# EAGLE design Final Board Miniaturized (EAGLE 7.2.0)
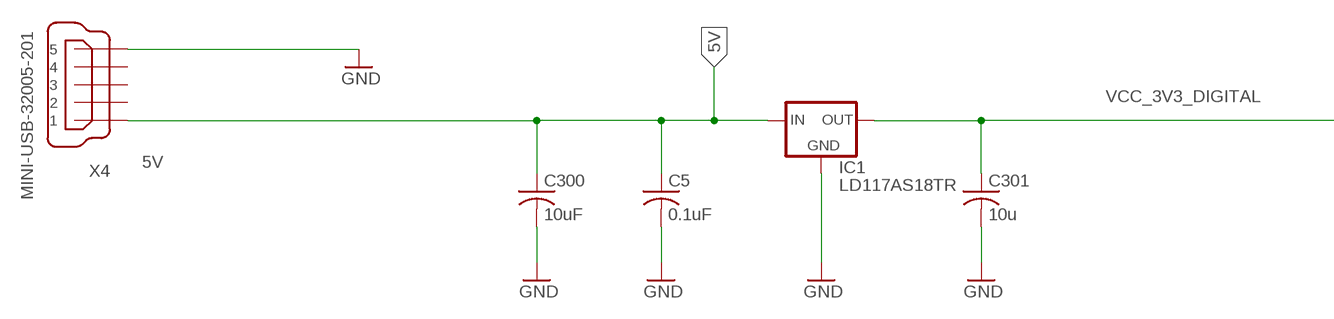
[diagram p0: schematic, sheet 1, part 1 of 2]
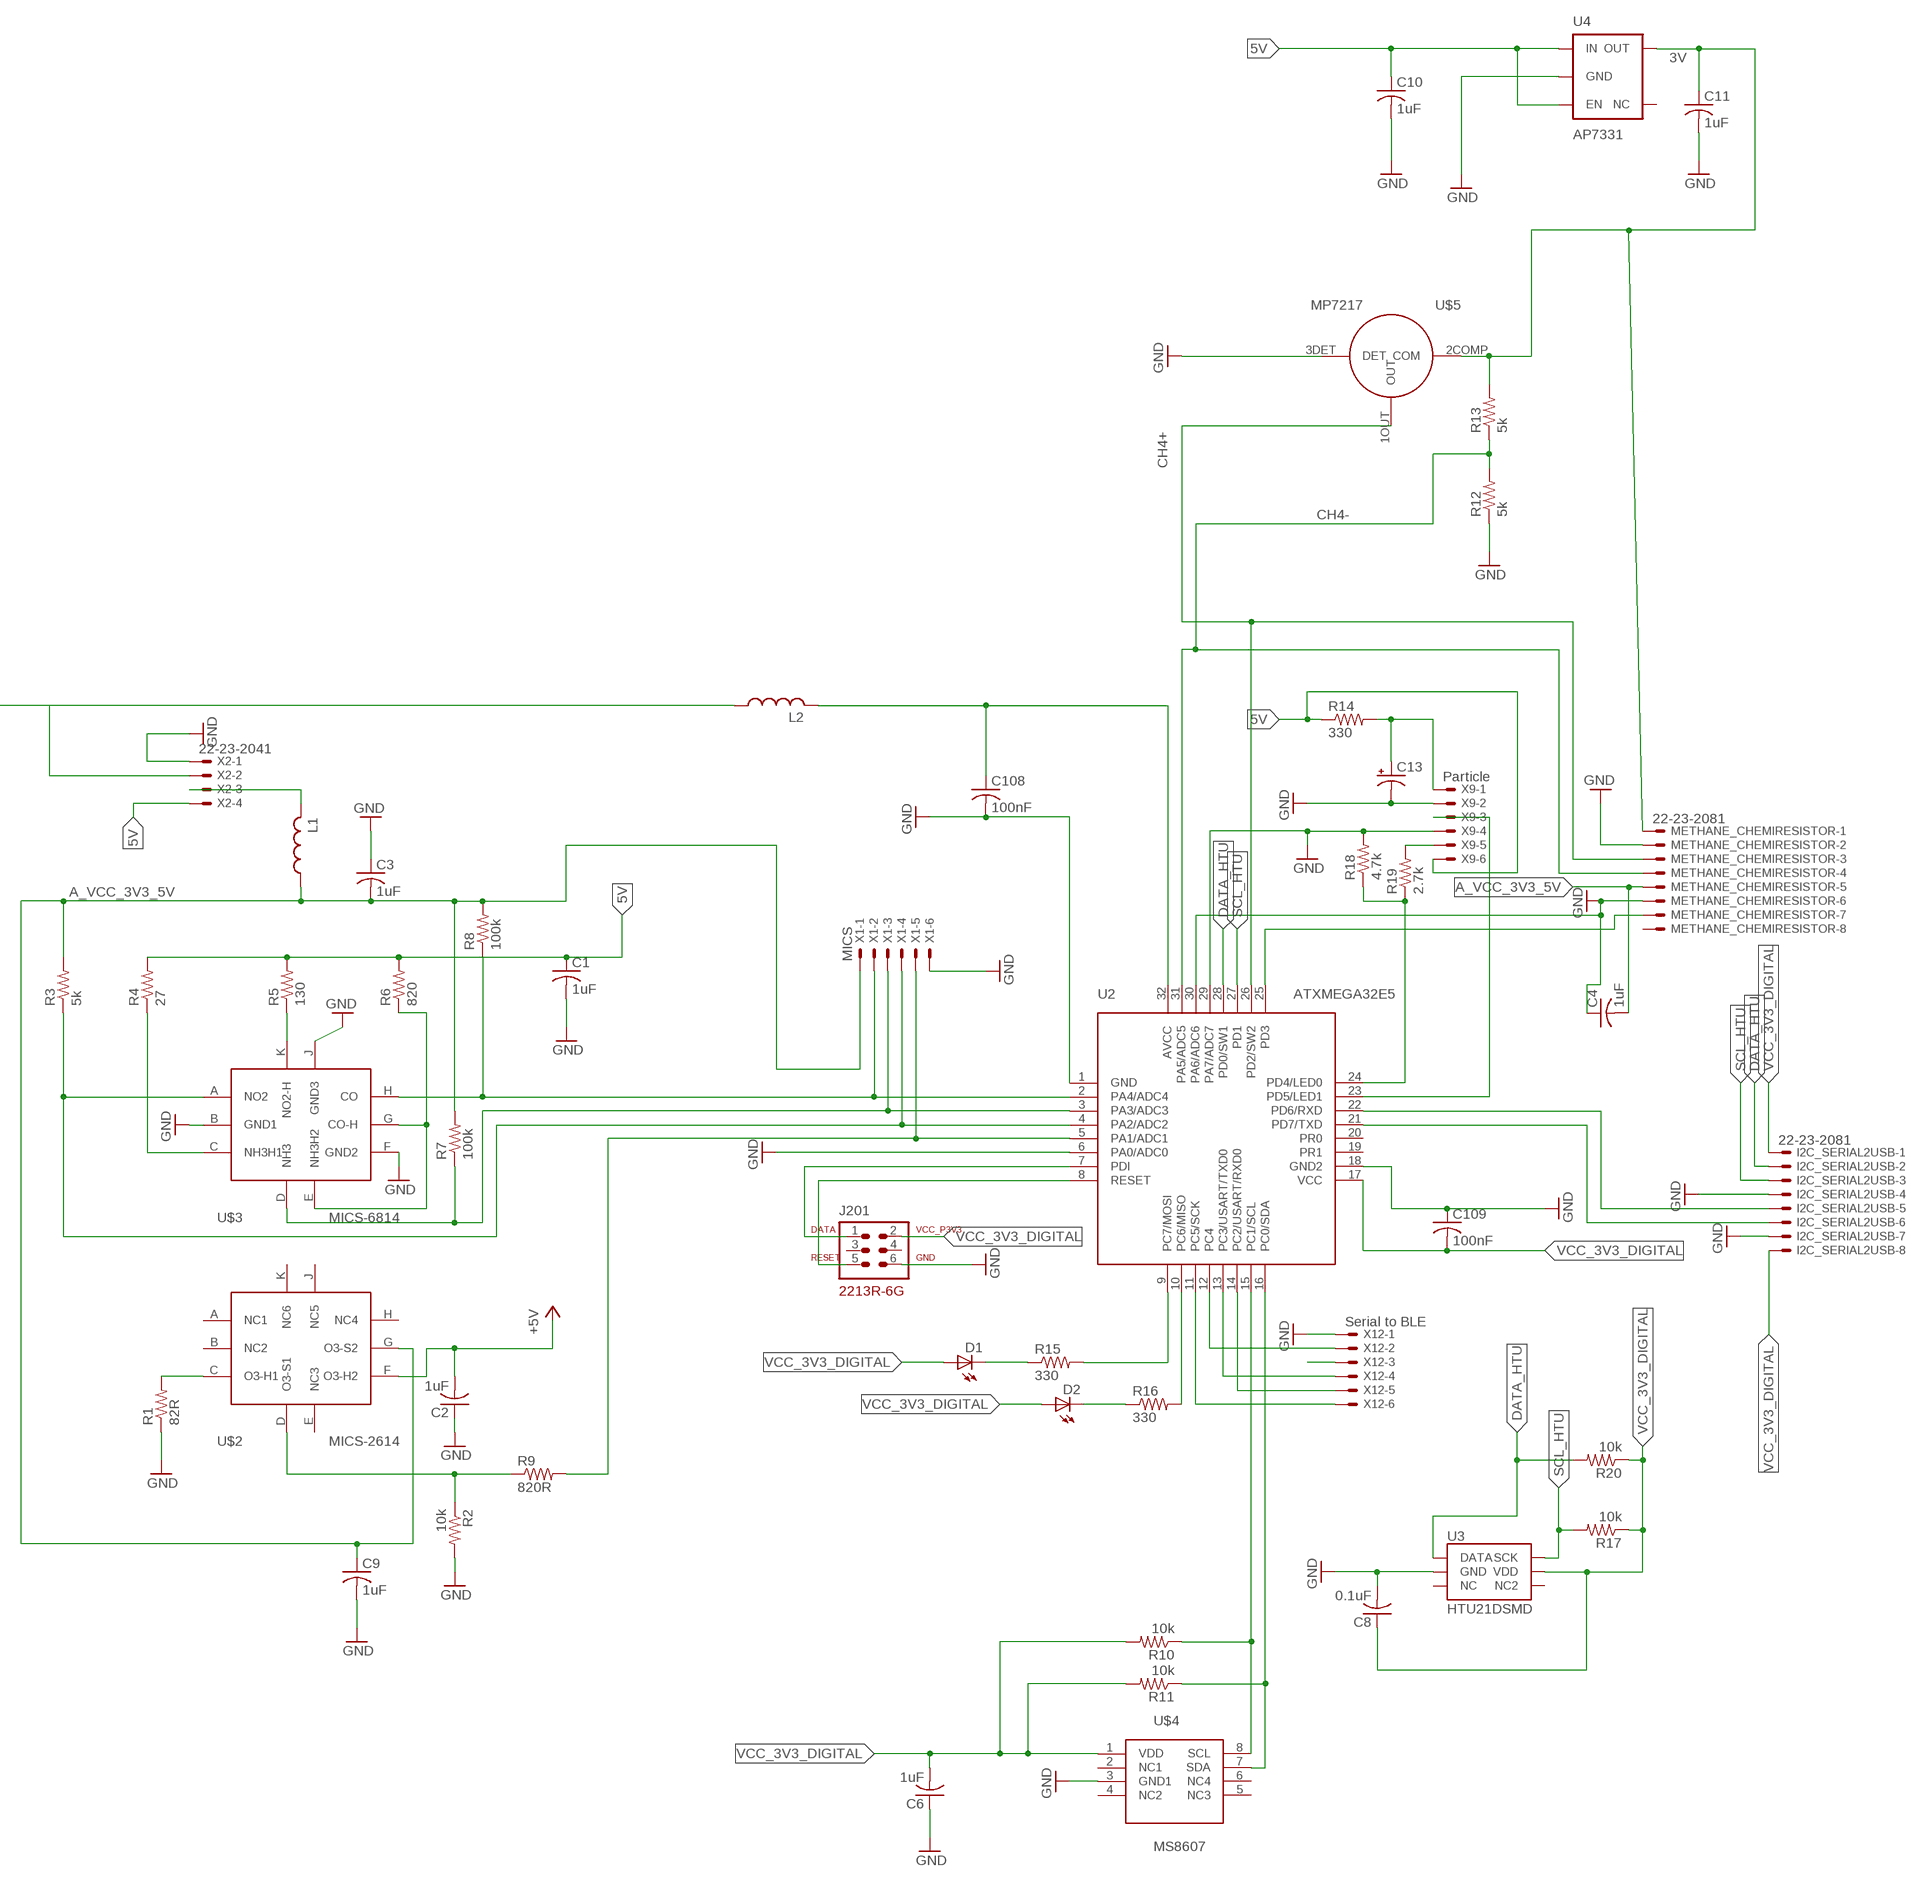
[diagram p1: schematic, sheet 1, part 2 of 2]

## Parts
C1  1uF  C-USC0805  [C0805]
C2  1uF  C-USC0805  [C0805]
C3  1uF  C-USC0805  [C0805]
C4  1uF  C-USC0805  [C0805]
C5  0.1uF  C-USC0603  [C0603]
C6  1uF  C-USC0805  [C0805]
C8  0.1uF  C-USC0805  [C0805]
C9  1uF  C-USC0805  [C0805]
C10  1uF  C-USC0805  [C0805]
C11  1uF  C-USC0805  [C0805]
C13  CPOL-USD  [PANASONIC_D]
C108  100nF  C-USC0402  [C0402]
C109  100nF  C-USC0402  [C0402]
C300  10uF  C-USC1206  [C1206]
C301  10u  C-USC1206  [C1206]
D1  LEDSML0805  [SML0805]
D2  LEDSML0805  [SML0805]
I2C_SERIAL2USB  22-23-2081  [22-23-2081]
IC1  LD117AS18TR  [SOT223]
J201  PDI  AVR-ISP-6  [AVR-ISP-6]
L1  0603INDUCTOR  [R0603]
L2  0603INDUCTOR  [R0603]
METHANE_CHEMIRESISTOR  22-23-2081  [22-23-2081]
R1  82R  R-US_R0805  [R0805]
R2  10k  R-US_R0805  [R0805]
R3  5k  R-US_R0805  [R0805]
R4  27  R-US_R0805  [R0805]
R5  130  R-US_R0805  [R0805]
R6  820  R-US_R0805  [R0805]
R7  100k  R-US_R0805  [R0805]
R8  100k  R-US_R0805  [R0805]
R9  820R  R-US_R0805  [R0805]
R10  10k  R-US_R0805  [R0805]
R11  10k  R-US_R0805  [R0805]
R12  5k  R-US_R0805  [R0805]
R13  5k  R-US_R0805  [R0805]
R14  330  R-US_R0402  [R0402]
R15  330  R-US_R0402  [R0402]
R16  330  R-US_R0402  [R0402]
R17  10k  R-US_R0805  [R0805]
R18  4.7k  R-US_R0402  [R0402]
R19  2.7k  R-US_R0402  [R0402]
R20  10k  R-US_R0805  [R0805]
U2  ATMEGA328P_TQFP  ATXMEGA32E5  [ATXMEGA32E5]
U3  HTU21DSMD  [HTU21D]
U4  AP2202-ADJ  AP7331  [AP7331]
U$2  MICS-2614-SMD8  [MICS-2614-SMD8]
U$3  MICS-6814-SMD8  [MICS-6814-SMD8]
U$4  PTH  [PTHSENSOR]
U$5  MP-7217  [MP-7217]
X1  MICS  22-23-2061  [22-23-2061]
X2  22-23-2041  [22-23-2041]
X4  MINI-USB-32005-201  [32005-201]
X9  Particle  22-23-2061  [22-23-2061]
X12  Serial to BLE  22-23-2061  [22-23-2061]

## Nets
3V: C11.1 METHANE_CHEMIRESISTOR.1 R13.2 U4.5(OUT) U$5.2COMP(COM)
5V: C1.1 C2.2 C5.1 C10.1 C300.1 IC1.3(IN) R4.2 R5.2 R6.2 R14.1 U4.1(IN) U4.3(EN) U$2.F(O3-H2) X2.4 X4.1 X9.6 ; supply symbol labelled +5V
A_VCC_3V3_5V: C3.2 C4.2 C9.1 L1.1 METHANE_CHEMIRESISTOR.5 R3.2 R7.2 R8.2 U$2.G(O3-S2) X1.1
ADC: R9.2 U2.5(PA1/ADC1) X1.5
AVCC_MC: C108.1 L2.2 U2.32(AVCC)
CH4+: METHANE_CHEMIRESISTOR.3 U2.26(PD2/SW2) U$5.1OUT(OUT)
CH4-: METHANE_CHEMIRESISTOR.4 R12.2 R13.1 U2.31(PA5/ADC5)
DATA_HTU: I2C_SERIAL2USB.2 R20.2 U2.28(PD0/SW1) U3.DATA
GND: C1.2 C2.1 C3.1 C4.1 C5.2 C6.1 C8.2 C9.2 C10.2 C11.2 C13.- C108.2 C109.1 C300.2 C301.2 I2C_SERIAL2USB.4 I2C_SERIAL2USB.7 IC1.1(GND) J201.6(GND) METHANE_CHEMIRESISTOR.2 METHANE_CHEMIRESISTOR.6 R1.1 R2.2 R12.1 R18.2 U2.1(GND) U2.6(PA0/ADC0) U2.18(GND2) U2.29(PA7/ADC7) U2.30(PA6/ADC6) U3.GND U4.2(GND) U$3.B(GND1) U$3.F(GND2) U$3.J(GND3) U$4.3(GND1) U$5.3DET(DET) X1.6 X2.1 X4.5 X9.2 X9.4 X12.1
IC1: R3.1 U2.4(PA2/ADC2) U$3.A(NO2) X1.4
N$1: R1.2 U$2.C(O3-H1)
N$2: J201.1(DATA) U2.7(PDI)
N$3: J201.5(RESET) U2.8(RESET)
N$4: R16.2 U2.10(PC6/MISO)
N$5: METHANE_CHEMIRESISTOR.7 U2.25(PD3)
N$6: I2C_SERIAL2USB.5 U2.22(PD6/RXD)
N$7: R7.1 U2.3(PA3/ADC3) U$3.D(NH3) X1.3
N$8: R6.1 U$3.E(NH3H2) U$3.G(CO-H)
N$9: R5.1 U$3.K(NO2-H)
N$10: R4.1 U$3.C(NH3H1)
N$12: R8.1 U2.2(PA4/ADC4) U$3.H(CO) X1.2
N$14: R10.1 U2.15(PC1/SCL) U$4.8(SCL)
N$15: R18.1 R19.1 U2.24(PD4/LED0)
N$16: U2.23(PD5/LED1) X9.3
N$17: R11.1 U2.16(PC0/SDA) U$4.7(SDA)
N$18: R19.2 X9.5
N$19: U2.13(PC3/USART/TXD0) X12.4
N$20: U2.14(PC2/USART/RXD0) X12.5
N$21: R2.1 R9.1 U$2.D(O3-S1)
N$22: C13.+ R14.2 X9.1
N$23: L1.2 X2.3
N$24: I2C_SERIAL2USB.6 U2.21(PD7/TXD)
N$26: D1.C R15.1
N$27: U2.12(PC4) X12.2
N$28: D2.C R16.1
N$29: R15.2 U2.9(PC7/MOSI)
N$31: U2.11(PC5/SCK) X12.6
N$32: X12.3
SCL_HTU: I2C_SERIAL2USB.3 R17.2 U2.27(PD1) U3.SCK
VCC_3V3_DIGITAL: C6.2 C8.1 C109.2 C301.1 D1.A D2.A I2C_SERIAL2USB.1 I2C_SERIAL2USB.8 IC1.2(OUT) J201.2(VCC_P3V3) L2.1 R10.2 R11.2 R17.1 R20.1 U2.17(VCC) U3.VDD U$4.1(VDD) X2.2
Unconnected: J201.3(NC1) J201.4(NC2) METHANE_CHEMIRESISTOR.8 U2.19(PR1) U2.20(PR0) U3.NC@6(NC2) U4.4(NC) U$2.A(NC1) U$2.B(NC2) U$2.E(NC3) U$2.H(NC4) U$2.J(NC5) U$2.K(NC6) U$4.2(NC1) U$4.4(NC2) U$4.5(NC3) U$4.6(NC4) X4.2 X4.3 X4.4

## Power pins joined to a net without a drawn wire
NC: U3.NC@1(NC)

## Library data of the parts
C1-C6 C8-C11 C108 C109 C300 C301 = resistor:C-US: CAPACITOR, American symbol
C13 = rcl:CPOL-US: POLARIZED CAPACITOR, American symbol
D1 D2 = led:LED: LED OSRAM: - CHIPLED LG R971, LG N971, LY N971, LG Q971, LY Q971, LO R971, LY R971 LH N974, LH R974 LS Q976, LO Q976, LY Q976 LO Q996 - Hyper CHIPLED LW Q18S LB Q993, LB Q99A, LB R99A - SideLED LS A670, LO A670, LY A670, LG A670, LP A670 LB A673, LV A673, LT A673, LW A673 LH A674 LY A675 LS A676, LA A676, LO A676, LY A676, LW A676 LS A679, LY A679, LG A679 - Hyper Micro SIDELED® LS Y876, LA Y876, LO Y876, LY Y876 LT Y87S - SmartLED LW L88C, LW L88S LB L89C, LB L89S, LG L890 LS L89K, LO L89K, LY L89K LS L896, LA L896, LO L896, LY L896 - TOPLED LS T670, LO T670, LY T670, LG T670, LP T670 LSG T670, LSP T670, LSY T670, LOP T670, LYG T670 LG T671, LOG T671, LSG T671 LB T673, LV T673, LT T673, LW T673 LH T674 LS T676, LA T676, LO T676, LY T676, LB T676, LH T676, LSB T676, LW T676 LB T67C, LV T67C, LT T67C, LS T67K, LO T67K, LY T67K, LW E67C LS E67B, LA E67B, LO E67B, LY E67B, LB E67C, LV E67C, LT E67C LW T67C LS T679, LY T679, LG T679 LS T770, LO T770, LY T770, LG T770, LP T770 LB T773, LV T773, LT T773, LW T773 LH T774 LS E675, LA E675, LY E675, LS T675 LS T776, LA T776, LO T776, LY T776, LB T776 LHGB T686 LT T68C, LB T68C - Hyper Mini TOPLED® LB M676 - Mini TOPLED Santana® LG M470 LS M47K, LO M47K, LY M47K Source: http://www.osram.convergy.de LUXEON: - LUMILED® LXK2-PW12-R00, LXK2-PW12-S00, LXK2-PW14-U00, LXK2-PW14-V00 LXK2-PM12-R00, LXK2-PM12-S00, LXK2-PM14-U00 LXK2-PE12-Q00, LXK2-PE12-R00, LXK2-PE12-S00, LXK2-PE14-T00, LXK2-PE14-U00 LXK2-PB12-K00, LXK2-PB12-L00, LXK2-PB12-M00, LXK2-PB14-N00, LXK2-PB14-P00, LXK2-PB14-Q00 LXK2-PR12-L00, LXK2-PR12-M00, LXK2-PR14-Q00, LXK2-PR14-R00 LXK2-PD12-Q00, LXK2-PD12-R00, LXK2-PD12-S00 LXK2-PH12-R00, LXK2-PH12-S00 LXK2-PL12-P00, LXK2-PL12-Q00, LXK2-PL12-R00 Source: www.luxeon.com KINGBRIGHT: KA-3528ASYC Source: www.kingbright.com
I2C_SERIAL2USB METHANE_CHEMIRESISTOR = con-molex:22-23-2081: .100" (2.54mm) Center Header - 8 Pin; MF: MOLEX; MPN: 22-23-2081; OC_FARNELL: 1756826; OC_NEWARK: 01C7592
IC1 = Modified NCP1117LP:LD117A?*: Low drop fixed and adjustable positive voltage regulators 1 A Source: http://www.st.com/stonline/products/literature/ds/7194/ld1117axx.pdf
J201 = PDI Interface:AVR-ISP-6: PDI Interface for XMEGA
L1 L2 = 0603 Inductor:0603INDUCTOR: INDUCTOR, American symbol
R1-R20 = resistor:R-US_: RESISTOR, American symbol
U2 = ATXMEGA 32E5:ATXMEGA32E5: Microcontroller by Atmel; PROD_ID: IC-09069
U3 = SparkFun-Sensors:HTU21D; PROD_ID: IC-11793
U4 = AP7331:AP7331: 3V Voltage Regulator from Diodes, Inc.; PROD_ID: VREG-12189
U$2 = MICS2614:MICS-2614-SMD8: MICS-6814, NO2, NH3, CO
U$3 = MICS6814:MICS-6814-SMD8: MICS-6814, NO2, NH3, CO
U$4 = MS8607:PTH: PTH Sensor from Measurement Specialties
U$5 = MP-7217:MP-7217: Methane Sensor (Pellistor)
X1 X9 X12 = con-molex:22-23-2061: .100" (2.54mm) Center Header - 6 Pin; MF: MOLEX; MPN: 22-23-2061; OC_FARNELL: 1462922; OC_NEWARK: 27C1933
X2 = con-molex:22-23-2041: .100" (2.54mm) Center Header - 4 Pin; MF: MOLEX; MPN: 22-23-2041; OC_FARNELL: 1462920; OC_NEWARK: 38C0355
X4 = con-cypressindustries:MINI-USB-: MINI USB-B Conector Source: www.cypressindustries.com; OC_FARNELL: unknown; OC_NEWARK: unknown

## Board
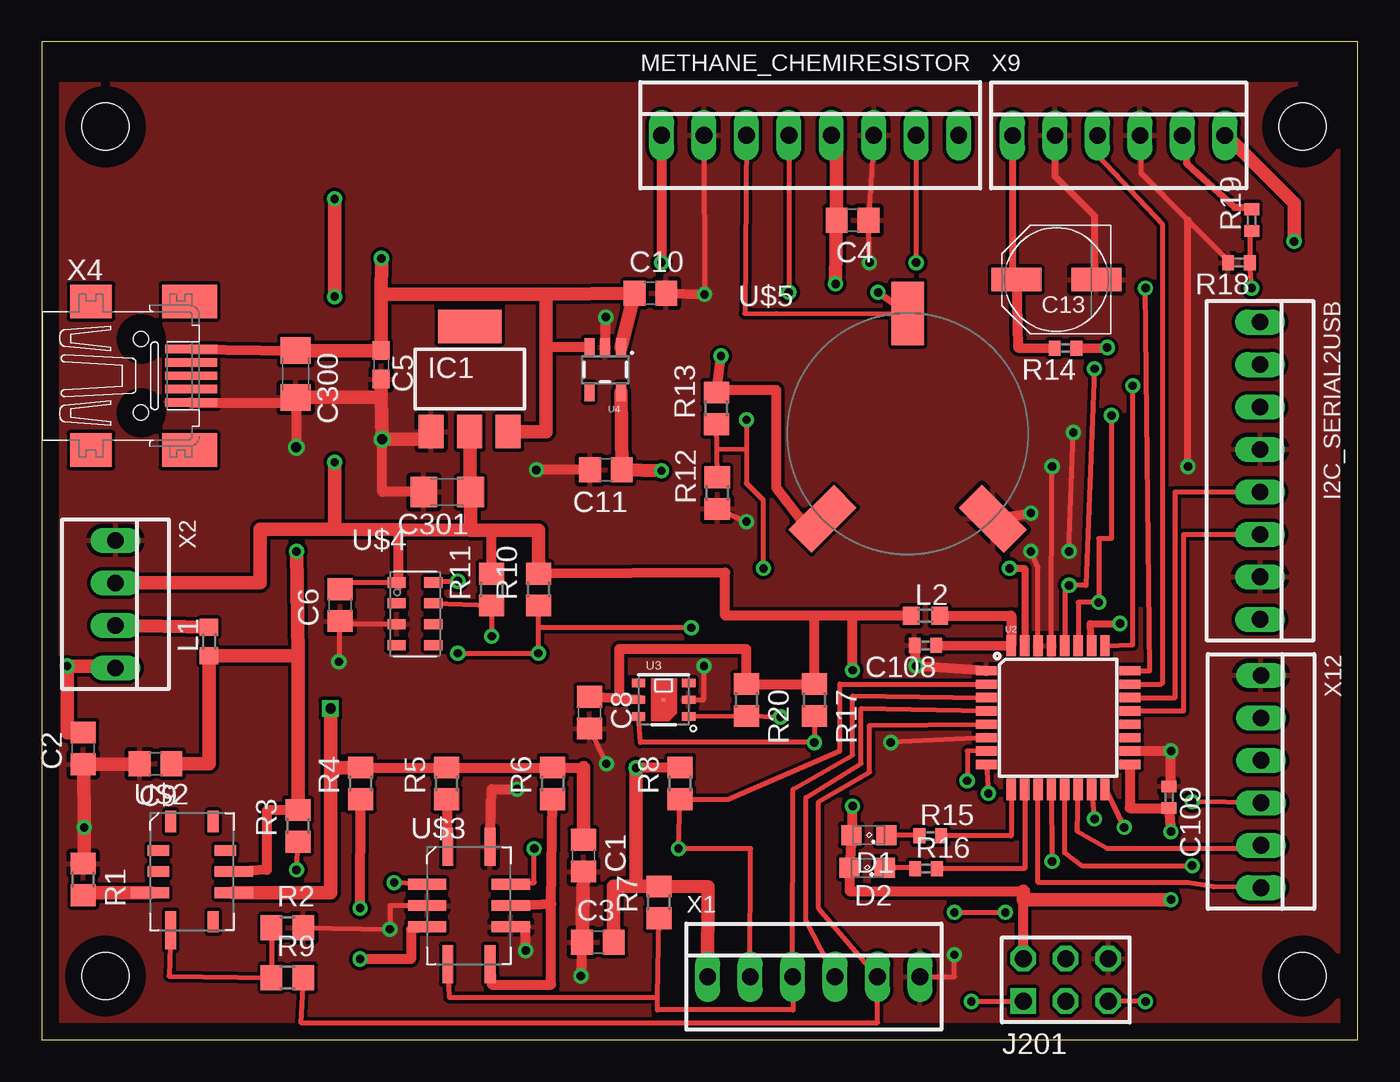
[diagram p2: board, top side]
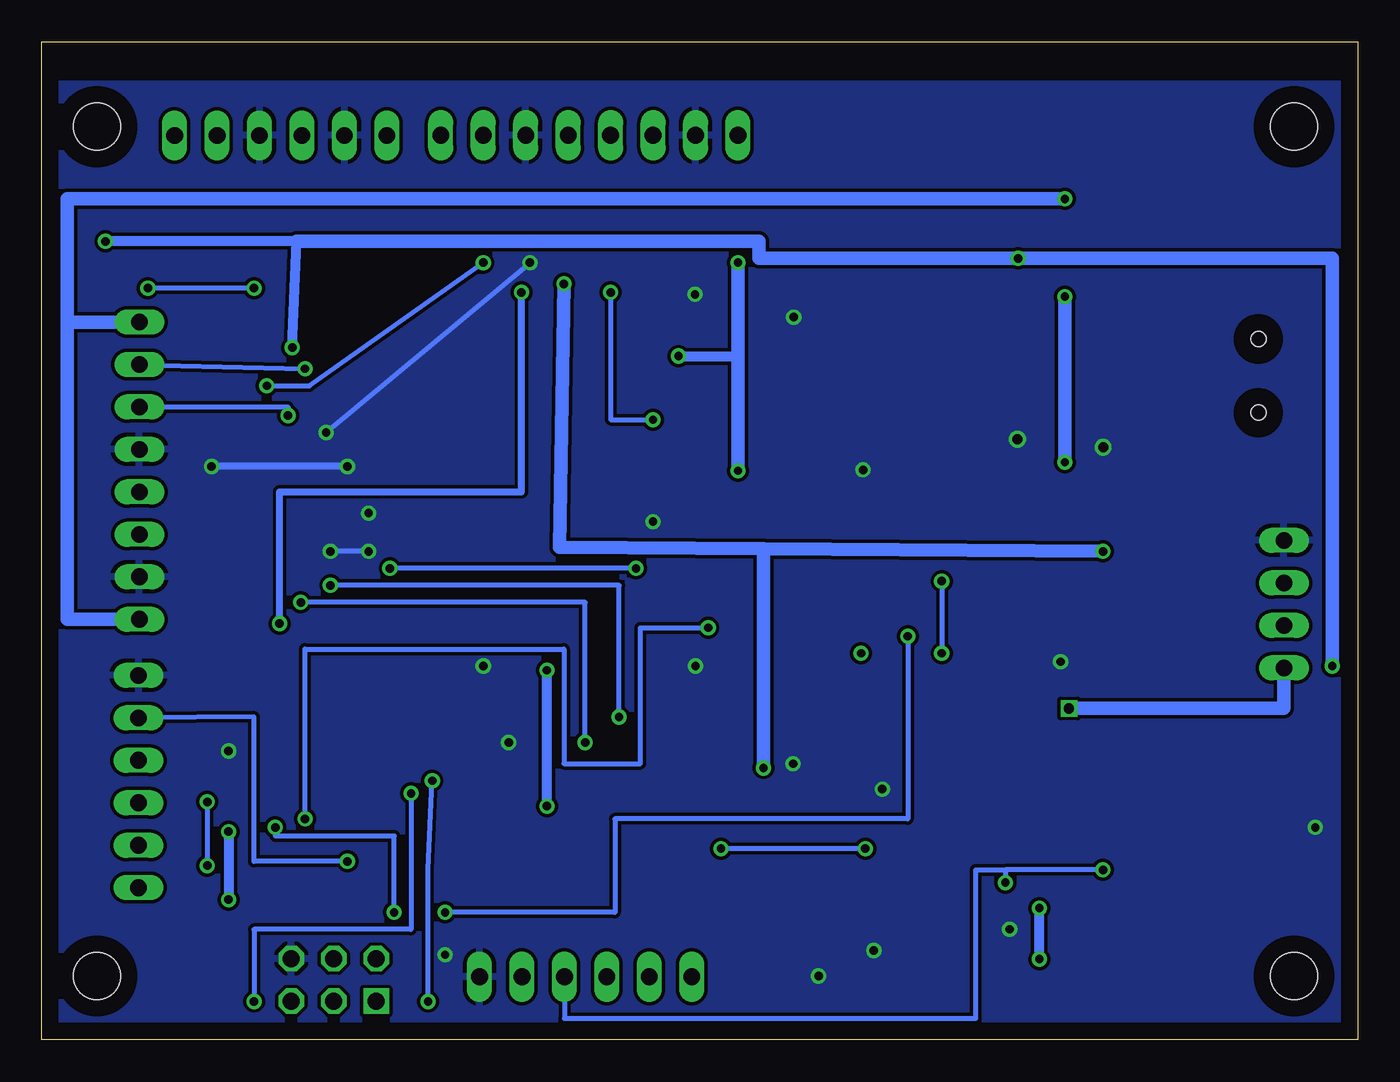
[diagram p3: board, bottom side, seen from below]

Size 78.74 x 59.69 mm. Coordinates in mm from the lower left corner, seen from the top.
Outline: 0,0 78.74,0 78.74,59.69 0,59.69 0,0
Copper layers (1*16): Top 0.035mm / dielectric 1.5mm / Bottom 0.035mm
Design rules "default": minimum track width 10mil, minimum drill 24mil, track to track 8mil, track to pad 8mil, pad to pad 8mil, via to via 8mil, smd to smd 8mil, copper to edge 40mil, drill to drill 8mil, minimum pad ring 10mil, minimum via ring 8mil, stop-mask expansion 4mil, vias tented up to drill 0mil, thermal gap 10mil
Holes 2.8 mm at 3.81,3.81 3.81,54.61 75.44,3.81 75.44,54.61

### Footprints (pad centres in the part's own frame; a part is rotated, then mirrored left to right if it is on the bottom)
C0805 = smd 1.3 x 1.5: 1 -0.95,0; 2 0.95,0
C0603 = smd 1.1 x 1: 1 -0.85,0; 2 0.85,0
PANASONIC_D = smd 3 x 1.4: + 2.4,0; - -2.4,0
C0402 = smd 0.7 x 0.9: 1 -0.65,0; 2 0.65,0
C1206 = smd 1.6 x 1.8: 1 -1.4,0; 2 1.4,0
SML0805 = smd 1.2 x 1.2: A 1.05,0; C -1.05,0
22-23-2081 = drill 1 long: 1 -8.89,0; 2 -6.35,0; 3 -3.81,0; 4 -1.27,0; 5 1.27,0; 6 3.81,0; 7 6.35,0; 8 8.89,0
SOT223 = smd 1.5 x 2: 1 -2.3,-3.15; 2 0,-3.15; 3 2.3,-3.15 | smd 3.8 x 2: 4 0,3.15
AVR-ISP-6 = drill 1.016 square: 1 -2.54,-1.27 | drill 1.016 octagon: 2 -2.54,1.27; 3 0,-1.27; 4 0,1.27; 5 2.54,-1.27; 6 2.54,1.27
R0603 = smd 1 x 1.1: 1 -0.85,0; 2 0.85,0
R0805 = smd 1.3 x 1.5: 1 -0.95,0; 2 0.95,0
R0402 = smd 0.7 x 0.9: 1 -0.65,0; 2 0.65,0
ATXMEGA32E5 = smd 1.27 x 0.559: 1 -4.293,2.8; 2 -4.293,2; 3 -4.293,1.2; 4 -4.293,0.4; 5 -4.293,-0.4; 6 -4.293,-1.2; 7 -4.293,-2; 8 -4.293,-2.8; 17 4.293,-2.8; 18 4.293,-2; 19 4.293,-1.2; 20 4.293,-0.4; 21 4.293,0.4; 22 4.293,1.2; 23 4.293,2; 24 4.293,2.8 | smd 0.559 x 1.27: 9 -2.8,-4.293; 10 -2,-4.293; 11 -1.2,-4.293; 12 -0.4,-4.293; 13 0.4,-4.293; 14 1.2,-4.293; 15 2,-4.293; 16 2.8,-4.293; 25 2.8,4.293; 26 2,4.293; 27 1.2,4.293; 28 0.4,4.293; 29 -0.4,4.293; 30 -1.2,4.293; 31 -2,4.293; 32 -2.8,4.293
HTU21D = smd 0.2 x 0.2: 7 0,0 | smd 0.8 x 0.5: DATA 1.5,-1; GND 1.5,0; NC@1 -1.5,1; NC@6 1.5,1; SCK -1.5,-1; VDD -1.5,0
AP7331 = smd 1.05 x 0.6: 1 -1.35,0.95; 2 -1.35,0; 3 -1.35,-0.95; 4 1.35,-0.95; 5 1.35,0.95
MICS-2614-SMD8 = smd 1.27 x 0.635: A -2,1.27; B -2,0; H 2,1.27 | smd 2.286 x 0.635: C -2.508,-1.27; F 2.508,-1.27; G 2.508,0 | smd 0.635 x 2.286: D -1.27,-3.508 | smd 0.635 x 1.27: E 1.27,-3; J 1.27,3; K -1.27,3
MICS-6814-SMD8 = smd 2.286 x 0.635: A -2.508,1.27; B -2.508,0; C -2.508,-1.27; F 2.508,-1.27; G 2.508,0; H 2.508,1.27 | smd 0.635 x 2.286: D -1.27,-3.508; E 1.27,-3.508; J 1.27,3.508; K -1.27,3.508
PTHSENSOR = smd 1.1 x 0.6: 1 -1.1,1.875; 2 -1.1,0.625; 3 -1.1,-0.625; 4 -1.1,-1.875; 5 1.1,-1.875; 6 1.1,-0.625; 7 1.1,0.625; 8 1.1,1.875
MP-7217 = smd 1.93 x 3.81: 1OUT 0,7.2 | smd 3.81 x 1.93 rotated 45: 2COMP -5.09,-5.09 | smd 3.81 x 1.93 rotated 135: 3DET 5.09,-5.09
22-23-2061 = drill 1 long: 1 -6.35,0; 2 -3.81,0; 3 -1.27,0; 4 1.27,0; 5 3.81,0; 6 6.35,0
22-23-2041 = drill 1 long: 1 -3.81,0; 2 -1.27,0; 3 1.27,0; 4 3.81,0
32005-201 = smd 3.1 x 0.5: 1 3,1.6; 2 3,0.8; 3 3,0; 4 3,-0.8; 5 3,-1.6 | smd 2.5 x 2: M1 -3,-4.45; M2 -3,4.45 | smd 3.3 x 2: M3 2.9,4.45; M4 2.9,-4.45 | hole 0.9: 0,2.2; 0,-2.2

### Placement (x,y rotation side)
C1  32.41,11.01 270 top
C2  2.48,17.42 90 top
C3  33.27,5.84 0 top
C4  48.51,49.02 180 top
C5  20.31,40.37 270 top
C6  17.84,25.99 90 top
C8  32.77,19.56 270 top
C9  6.81,16.51 180 top
C10  36.41,44.64 0 top
C11  33.76,34.09 180 top
C13  60.71,45.47 180 top
C108  52.87,23.58 180 top
C109  67.44,14.5 270 top
C300  15.19,39.82 270 top
C301  24.25,32.76 180 top
D1  49.49,12.24 180 top
D2  49.38,10.28 180 top
I2C_SERIAL2USB  72.9,34.04 270 top
IC1  25.61,39.52 0 top
J201  61.27,3.58 0 top
L1  10,23.82 90 top
L2  52.87,25.36 0 top
METHANE_CHEMIRESISTOR  45.97,54.1 0 top
R1  2.48,9.59 270 top
R2  14.7,6.69 0 top
R3  15.33,12.79 90 top
R4  19.08,15.33 90 top
R5  24.22,15.33 90 top
R6  30.57,15.33 90 top
R7  36.92,8.22 90 top
R8  38.19,15.33 90 top
R9  14.7,3.72 0 top
R10  29.72,26.92 90 top
R11  26.92,26.92 90 top
R12  40.42,32.7 90 top
R13  40.36,37.77 90 top
R14  61.26,41.37 180 top
R15  53.17,12.2 0 top
R16  52.91,10.23 0 top
R17  46.23,20.32 270 top
R18  71.63,46.48 180 top
R19  72.39,49.02 90 top
R20  42.16,20.32 270 top
U2  60.81,19.27 0 top
U3  37.21,20.34 0 top
U4  33.71,40.08 270 top
U$2  8.98,10.06 0 top
U$3  25.56,8.03 0 top
U$4  22.33,25.47 0 top
U$5  51.81,36.25 0 top
X1  46.2,3.77 0 top
X2  4.41,26.05 270 top
X4  5.94,39.71 0 top
X9  64.44,54.09 0 top
X12  72.96,15.44 270 top

### Tracks (layer width: path | path; a pad name or v marks a point on that pad's centre or on a via)
3V  (via drill 0.5)
  Top 0.305: 40.36,38.86 R13.2
  Top 0.61: METHANE_CHEMIRESISTOR.1 v37.08,46.48 | R13.2 v40.64,40.89 | U$5.2COMP 45.97,30.39 43.94,33.02 43.94,38.86 40.36,38.86
  Top 0.813: U4.5 C11.1 v37.08,34.04
  Bottom 0.61: v40.64,40.89 37.08,40.89
  Bottom 0.813: v37.08,46.48 37.08,40.89 v37.08,34.04
5V  (via drill 0.5, 0.6)
  Top 0.305: 32.41,16.26 32.51,16.26
  Top 0.406: X9.6 70.88,54.09
  Top 0.61: 20.31,44.45 20.31,44.58 | U4.3 30.17,41.43 | 4.41,22.35 X2.4 | R14.1 v63.75,41.4 | R4.2 R5.2 R6.2 32.51,16.26 | X4.1 C300.1
  Top 0.813: C300.1 C5.1 20.31,44.45 v20.32,46.74 | 20.31,44.58 30.17,44.58 | 30.17,44.58 30.17,41.43 30.17,36.37 IC1.3 | 30.17,44.58 C10.1 U4.1 | 4.41,22.35 v1.52,22.35 1.52,18.37 C2.2 | 70.88,54.09 74.93,50.04 v74.93,47.75 | U$2.F 17.27,8.79 17.27,16.28 | 17.27,16.28 v17.27,19.81 | R4.2 17.27,16.28 | C1.1 32.41,16.26
  Bottom 0.61: v74.93,47.75 63.5,47.75 v63.75,41.4
  Bottom 0.813: v1.52,22.35 1.52,46.74 v20.32,46.74 35.81,46.74 35.81,47.75 63.5,47.75 | v17.27,19.81 4.41,19.81 X2.4
A_VCC_3V3_5V  (via drill 0.5)
  Top 0.305: METHANE_CHEMIRESISTOR.5 arc-90 47.56,53.78 | 47.56,49.53 C4.2
  Top 0.61: R3.2 13.46,13.72 13.46,10.16 U$2.G | R8.2 v35.56,16.26
  Top 0.813: 15.33,22.97 L1.1 10,16.51 C9.1 | 15.33,22.97 R3.2 | v15.24,29.21 15.33,22.97 | 47.56,53.78 47.56,49.53 v47.5,45.21 | v35.56,16.26 35.56,9.17 | 35.56,9.17 R7.2 39.88,9.14 X1.1 | C3.2 34.22,9.17 35.56,9.17
  Bottom 0.813: v15.24,29.21 35.56,29.36 | 35.56,29.36 47.75,29.46 v47.5,45.21 | v35.56,16.26 35.56,29.36
ADC
  Top 0.305: U2.5 49.53,18.8 49.53,16 46.48,14.22 46.48,7.87 X1.5 50.01,1.02 15.49,1.02 R9.2
AVCC_MC
  Top 0.61: C108.1 U2.32 58.01,25.36 L2.2
CH4+  (via drill 0.5)
  Top 0.305: METHANE_CHEMIRESISTOR.3 42.07,43.44 43.94,43.43 U$5.1OUT
  Top 0.406: U2.26 62.74,24.89 v64.52,24.89 | v50.04,44.7 U$5.1OUT
  Bottom 0.406: v64.52,24.89 64.52,32.77 50.04,32.77 v50.04,44.7
CH4-  (via drill 0.5)
  Top 0.305: R12.2 40.39,35.3 | 40.39,35.3 R13.1 | v43.18,28.19 43.18,32.26 42.16,33.27 42.16,35.31 | 42.16,35.31 40.39,35.3 | METHANE_CHEMIRESISTOR.4 v44.7,44.7 | v42.16,37.08 42.16,35.31
  Top 0.406: v57.91,28.19 58.81,28.19 U2.31
  Bottom 0.305: v44.7,44.7 44.7,37.08 v42.16,37.08 | v43.18,28.19 v57.91,28.19
DATA_HTU  (via drill 0.5)
  Top 0.305: v62.99,40.13 62.48,27.18 v61.47,27.18 61.21,27.18 U2.28 | U3.DATA R20.2 v44.2,19.3
  Bottom 0.305: I2C_SERIAL2USB.2 v62.99,40.13 | v44.2,19.3 44.2,27.18 v61.47,27.18
GND  (via drill 0.5, 0.6)
  Top 0.305: METHANE_CHEMIRESISTOR.2 v39.66,44.58 | C6.1 17.84,24.85 U$4.3 17.78,24.85 v17.78,22.61 | R12.1 v42.16,30.99 | METHANE_CHEMIRESISTOR.6 C4.1 v49.53,46.48 | v61.47,29.21 v61.72,36.32 | C8.2 v33.78,16.51 | R2.2 v20.83,6.6 20.83,8.03 U$3.B | U2.6 v50.8,17.78 | X1.6 54.61,3.77 v54.61,5.08 | U3.GND 39.62,20.34 v39.62,22.35 | R18.2 70.98,46.62 68.58,49.02 65.79,51.82 65.79,54.02 | U2.29 v60.45,34.29 | U2.30 59.61,28.27 v59.18,29.21 | U2.18 | C109.1 67.56,15.28
  Top 0.406: X9.2 60.63,51.64 62.99,49.28 62.99,45.58 C13.- | v68.58,34.29 68.58,49.02
  Top 0.61: X4.5 14.88,38.11 arc90 C300.2 15.23,38.42 v15.23,35.44 | IC1.1 23.31,35.91 | U4.2 arc90 33.74,41.46 v33.74,43.22 | C301.2 20.36,32.76 v20.36,35.91 | C11.2 v29.6,34.08 | C10.2 v39.66,44.58 | U$5.3DET v59.18,31.5 | R1.1 2.54,10.54 | U2.1 v52.32,22.35 C108.2 | U$3.J 26.92,14.99 v28.45,14.99 | v28.96,5.33 28.96,6.76 U$3.F | C3.1 v32.26,3.81 | U2.18 v67.56,17.27 67.56,15.28
  Top 0.813: C5.2 20.31,38.42 | 20.31,38.42 C300.2 | 20.31,38.42 v20.36,35.91 23.31,35.91 | 2.54,10.54 v2.54,12.7 arc2 C2.1 5.86,16.47 C9.2 | C3.1 C1.2
  Bottom 0.305: v59.18,29.21 v61.47,29.21 | v61.72,36.32 v49.53,46.48
  Bottom 0.406: v60.45,34.29 v68.58,34.29
  pour Top: 78.1,0.16 0.31,0.31 0.31,57.15 78.25,57.15
  pour Bottom: 0.31,57.15 78.25,57.15 78.1,0.47 0.31,0.47
IC1  (via drill 0.5)
  Top 0.305: U$3.A v21.08,9.4 | v15.24,10.16 R3.1 | X1.4 45.72,7.11 45.72,14.48 49.02,16.51 49.02,19.81 U2.4
  Bottom 0.305: X1.4 47.47,1.27 22.86,1.27 22.86,10.16 21.08,10.16 | v15.24,10.16 21.08,10.16 | 21.08,10.16 v21.08,9.4
N$1
  Top 0.61: U$2.C | 2.48,8.79 R1.2
  Top 0.813: U$2.C 2.48,8.79
N$2  (via drill 0.5)
  Top 0.305: U2.7 55.37,17.27 v55.37,15.49 | v55.63,2.29 J201.1
  Bottom 0.305: v55.63,2.29 55.63,10.16 v55.37,15.49
N$3  (via drill 0.5)
  Top 0.305: U2.8 v56.64,14.73 | v66.04,2.29 J201.5
  Bottom 0.305: v56.64,14.73 56.64,6.6 66.04,6.6 v66.04,2.29
N$4
  Top 0.305: U2.10 58.81,10.23 R16.2
N$5  (via drill 0.5)
  Top 0.305: v52.32,46.48 METHANE_CHEMIRESISTOR.7 | U2.25 65.28,23.62 v65.28,39.12
  Bottom 0.305: v52.32,46.48 62.74,39.12 v65.28,39.12
N$6
  Top 0.305: U2.22 67.82,20.47 67.82,32.77 I2C_SERIAL2USB.5
N$7
  Top 0.305: U$3.D 24.38,2.54 36.83,2.54 | 36.83,2.54 R7.1 | 36.83,2.54 36.83,1.78 44.96,1.78 X1.3 44.96,14.99 48.51,17.02 48.51,20.57 U2.3
N$8
  Top 0.61: U$3.G 30.48,8.13 | 30.48,8.13 R6.1 | U$3.E 26.92,3.3 30.48,3.3 30.48,8.13
N$9
  Top 0.61: R5.1 U$3.K
N$10  (via drill 0.5)
  Top 0.61: U$3.C 22.1,6.6 22.1,4.83 v19.05,4.83 | v19.05,7.87 R4.1
  Bottom 0.61: v19.05,4.83 v19.05,7.87
N$12  (via drill 0.5)
  Top 0.305: U$3.H 29.46,9.4 v29.46,11.43 | X1.2 42.42,11.43 v38.1,11.43 R8.1 41.05,14.38 47.75,17.27 47.75,21.27 U2.2
  Bottom 0.305: v29.46,11.43 v38.1,11.43
N$14  (via drill 0.5)
  Top 0.305: U$4.8 23.43,27.43 v24.89,27.43 | v24.89,23.11 v29.72,23.11 29.72,24.64 | 29.72,24.64 R10.1 | U2.15 v62.99,13.21 | v38.86,24.64 29.72,24.64
  Bottom 0.305: v24.89,27.43 v24.89,23.11 | v62.99,13.21 62.99,23.37 47.5,23.37 47.5,16.51 42.93,16.51 42.93,24.64 v38.86,24.64
N$15  (via drill 0.5)
  Top 0.305: U2.24 66.29,22.07 v66.04,44.96 | R19.1 72.28,48.37 R18.1 v72.39,44.96
  Bottom 0.305: v66.04,44.96 v72.39,44.96
N$16
  Top 0.305: 65.12,21.28 U2.23 66.98,21.27 67.06,21.34 67.06,48.77 63.17,52.91 X9.3
N$17  (via drill 0.5)
  Top 0.305: U$4.7 R11.1 v26.92,24.13 | v54.61,7.62 v57.66,7.62 | v64.77,12.7 63.75,14.83 arc90 U2.16
  Bottom 0.305: v26.92,24.13 26.92,13.21 44.45,13.21 44.45,7.62 v54.61,7.62 | v57.66,7.62 57.66,12.19 64.77,12.19 v64.77,12.7
N$18
  Top 0.406: X9.5 68.5,52.4 71.37,49.78 72.28,49.78 R19.2
N$19  (via drill 0.5)
  Top 0.305: X12.4 v68.83,14.22 | U2.13 61.21,11.18 62.23,10.41 v68.83,10.41
  Bottom 0.305: v68.83,14.22 v68.83,10.41
N$20
  Top 0.305: U2.14 61.98,12.45 63.75,11.43 72.75,11.43 X12.5
N$21
  Top 0.305: U$2.D 7.62,3.81 R9.1 R2.1
N$22
  Top 0.406: X9.1 58.09,45.47 C13.+
  Top 0.61: C13.+ 58.42,41.4 R14.2
N$23
  Top 0.813: X2.3 L1.2
N$24
  Top 0.305: U2.21 68.33,19.67 68.33,30.23 I2C_SERIAL2USB.6
N$26
  Top 0.305: R15.1 52.52,12.24 D1.C
N$27  (via drill 0.5)
  Top 0.305: U2.12 v60.45,10.67
  Bottom 0.305: v60.45,10.67 66.04,10.67 66.04,19.3 X12.2
N$28
  Top 0.305: R16.1 52.27,10.28 D2.C
N$29
  Top 0.305: 58.01,14.99 U2.9 58.01,12.2 R15.2
N$31
  Top 0.305: U2.11 59.61,9.4 68.58,9.4 70.1,9.14 X12.6
SCL_HTU  (via drill 0.5)
  Top 0.305: v64.01,37.34 64.01,29.97 63.25,29.97 v63.25,26.16 62.01,26.16 U2.27 | U3.SCK 35.81,17.78 v46.23,17.78 R17.2
  Bottom 0.305: I2C_SERIAL2USB.3 64.01,37.85 v64.01,37.34 | v46.23,17.78 46.23,26.16 v63.25,26.16
VCC_3V3_DIGITAL  (via drill 0.5)
  Top 0.305: 21.34,27.18 21.34,27.35 U$4.1 17.84,27.35 C6.2
  Top 0.61: 21.34,27.18 21.34,30.51 | R11.2 26.92,30.48 | L2.1 48.51,25.36 | 48.51,25.36 46.23,25.36 | 46.23,25.36 40.89,25.36 40.89,27.94 R10.2 29.72,27.69 | U3.VDD 34.53,20.39 | 34.53,20.39 C8.1 | 34.53,20.39 34.54,23.37 42.16,23.37 R20.1 R17.1 46.23,25.36 | v67.56,12.45 C109.2 65.1,13.85 U2.17 | 58.73,8.89 48.33,8.89 D2.A D1.A 48.51,12.24 v48.51,13.97 | J201.2 58.73,8.38 | v48.51,22.1 48.51,25.36
  Top 0.813: IC1.2 C301.1 25.65,30.48 | 25.65,30.48 21.34,30.51 17.52,30.54 | X2.2 13.05,27.32 13.05,30.54 17.52,30.54 | 25.65,30.48 26.92,30.48 29.72,30.48 R10.2 | v17.53,50.29 v17.53,44.45 | v17.53,34.54 17.52,30.54 | 58.73,8.89 58.73,8.38 v67.56,8.38
  Bottom 0.61: v67.56,12.45 v67.56,8.38 | v48.51,13.97 v48.51,22.1
  Bottom 0.813: I2C_SERIAL2USB.1 77.22,42.93 | 77.22,42.93 77.22,50.29 v17.53,50.29 | v17.53,44.45 v17.53,34.54 | I2C_SERIAL2USB.8 77.22,25.15 77.22,42.93